# EAGLE design filaSens (EAGLE 9.6.2)
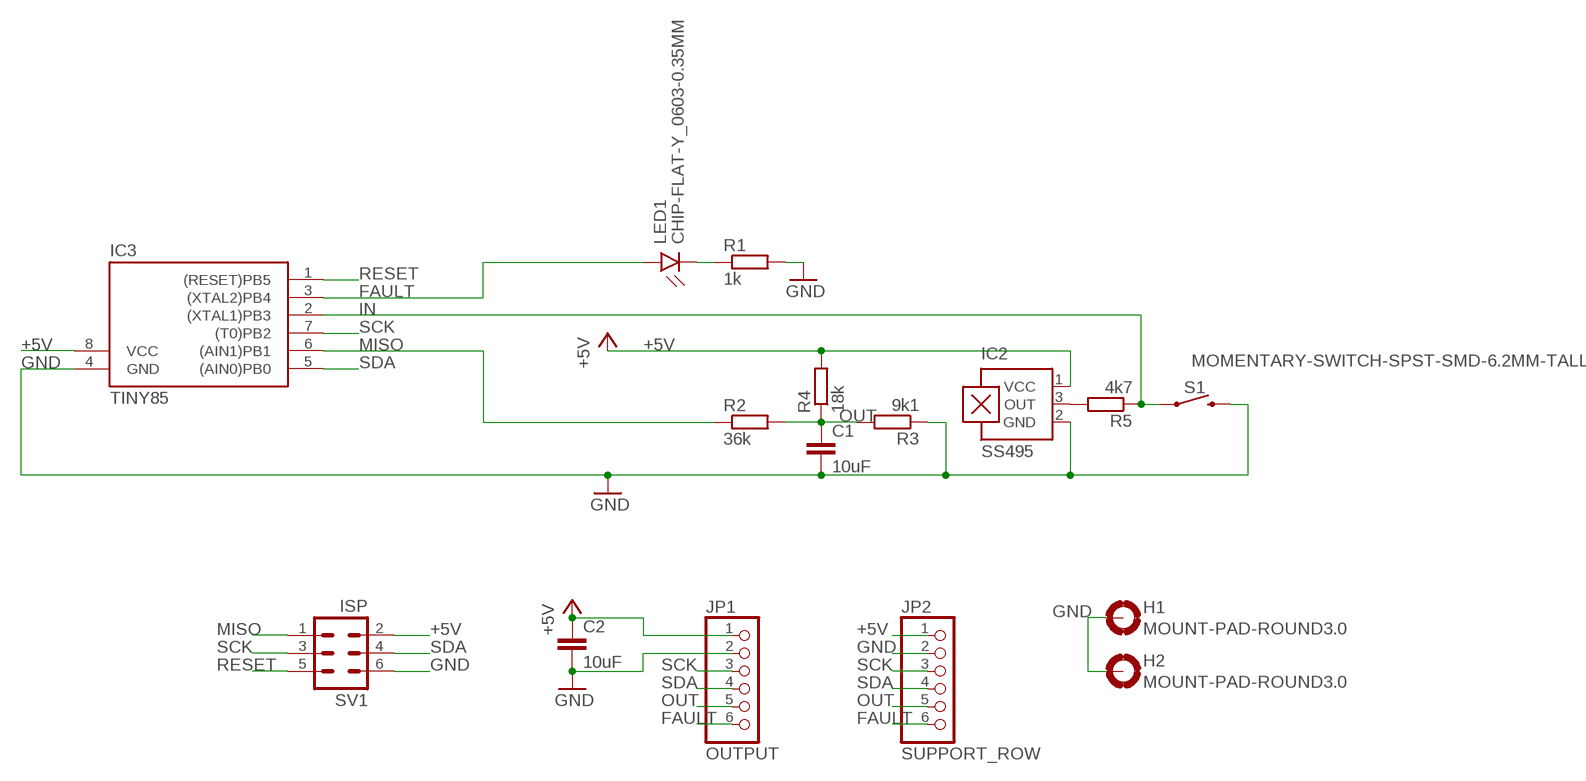
[diagram p0: schematic, sheet 1]

## Parts
C1  10uF  C-EUC0402  [C0402]
C2  10uF  C-EUC0402  [C0402]
H1  MOUNT-PAD-ROUND3.0  [3,0-PAD]
H2  MOUNT-PAD-ROUND3.0  [3,0-PAD]
IC2  SS495  A1302UA  [SIP3-UA]
IC3  TINY85  TINY10S  [SOIC8]
JP1  OUTPUT  PINHD-1X6  [1X06]
JP2  SUPPORT_ROW  PINHD-1X6  [1X06]
LED1  CHIP-FLAT-Y_0603-0.35MM  [LEDC1608X35N_FLAT-Y]
R1  1k  R-EU_R0402  [R0402]
R2  36k  R-EU_R0402  [R0402]
R3  9k1  R-EU_R0402  [R0402]
R4  18k  R-EU_R0402  [R0402]
R5  4k7  R-EU_R0402  [R0402]
S1  MOMENTARY-SWITCH-SPST-SMD-6.2MM-TALL  [TACTILE_SWITCH_SMD_6.2MM_TALL]
SV1  ISP  MA03-2  [MA03-2]

## Nets
+5V [power]: C2.1 IC2.1(VCC) IC3.8(VCC) JP1.1 JP2.1 R4.2 SV1.2
FAULT: IC3.3((XTAL2)PB4) JP1.6 JP2.6 LED1.A
GND [power]: C1.2 C2.2 H1.B3,0(MOUNT) H2.B3,0(MOUNT) IC2.2(GND) IC3.4(GND) JP1.2 JP2.2 R1.2 R3.1 S1.B2 SV1.6
IN: IC3.2((XTAL1)PB3) R5.1 S1.A2
MISO: IC3.6((AIN1)PB1) R2.1 SV1.1
N$1: IC2.3(OUT) R5.2
N$2: LED1.C R1.1
OUT: C1.1 JP1.5 JP2.5 R2.2 R3.2 R4.1
RESET: IC3.1((RESET)PB5) SV1.5
SCK: IC3.7((T0)PB2) JP1.3 JP2.3 SV1.3
SDA: IC3.5((AIN0)PB0) JP1.4 JP2.4 SV1.4

## Library data of the parts
C1 C2 = rcl:C-EU: CAPACITOR, European symbol; SPICEPREFIX: C
H1 H2 = holes:MOUNT-PAD-ROUND: MOUNTING PAD, round
IC2 = allegro:A13*?: Linear Hall Effect Sensor ICs Continuous-Time Ratiometric High-Temperature Operation Programmable Linear with Analog Output A1302 -Replacement- UGN3503 Source: http://www.allegromicro.com/en/Products/Part_Numbers/1301/1301.pdf http://www.allegromicro.com/en/Products/Part_Numbers/1321/1321.pdf http://www.allegromicro.com/en/Products/Part_Numbers/1381/1381.pdf; MF: ALLEGRO MICROSYSTEMS, INC.; MPN: A1302EUA-T; OC_FARNELL: 1521708; OC_NEWARK: 31K6639
IC3 = atmel:TINY10: MICROCONTROLLER 1 Kbytes ROM; OC_FARNELL: unknown; OC_NEWARK: unknown
JP1 JP2 = pinhead:PINHD-1X6: PIN HEADER
LED1 = LED:CHIP-FLAT-Y; CATEGORY: LED; COLOR: YELLOW; DESCRIPTION: CHIP LED FLAT; SUB-CATEGORY: CHIP; TYPE: FLAT_TOP
R1-R5 = rcl:R-EU_: RESISTOR, European symbol; SPICEPREFIX: R
S1 = SparkFun-Switches:MOMENTARY-SWITCH-SPST: Momentary Switch (Pushbutton) - SPST Normally-open (NO) SPST momentary switches (buttons, pushbuttons). Variants PTH-12MM - 12mm square, through-hole Momentary Pushbutton Switch - 12mm Square <https://www.sparkfun.com/products/9190> (COM-09190) PTH-6.0MM, PTH-6.0MM-KIT - 6.0mm square, through-hole Mini Pushbutton Switch <https://www.sparkfun.com/products/97> (COM-00097) KIT package intended for soldering kit's - only one side of pads' copper is exposed. PTH-RIGHT-ANGLE-KIT - Right-angle, through-hole Right Angle Tactile Button <https://www.sparkfun.com/products/10791> - Used on SparkFun BigTime Watch Kit <https://www.sparkfun.com/products/11734> SMD-12MM - 12mm square, surface-mount Tactile Button - SMD (12mm) <https://www.sparkfun.com/products/12993> (COM-12993) Used on SparkFun PicoBoard <https://www.sparkfun.com/products/11888> SMD-4.5MM - 4.5mm Square Trackball Switch Used on SparkFun Blackberry Trackballer Breakout <https://www.sparkfun.com/products/13169> SMD-4.6MMX2.8MM - 4.60mm x 2.80mm, surface mount Used on SparkFun SAMD21 Mini Breakout <https://www.sparkfun.com/products/13664> SMD-5.2MM, SMD-5.2-REDUNDANT - 5.2mm square, surface-mount Mini Pushbutton Switch - SMD <https://www.sparkfun.com/products/8720> (COM-08720) Used on Arduino Pro Mini <https://www.sparkfun.com/products/11114> REDUNDANT package connects both switch circuits together SMD-6.0X3.5MM - 6.0 x 3.5mm, surface mount Momentary Reset Switch SMD <https://www.sparkfun.com/products/8229> (COM-08229) SMD-6.2MM-TALL - 6.2mm square, surface mount Tactile Button - SMD (6mm) <https://www.sparkfun.com/products/12992> Used on SparkFun Digital Sandbox <https://www.sparkfun.com/products/12651> SMD-RIGHT-ANGLE - Right-angle, surface mount Used on SparkFun Block for Intel® Edison - Arduino <https://www.sparkfun.com/products/13036>; PROD_ID: SWCH-11966; SF_SKU: COM-12992
SV1 = con-lstb:MA03-2: PIN HEADER; OC_FARNELL: unknown; OC_NEWARK: unknown

## Net classes
0 default: width 0.254 mm
1 power: width 0.254 mm

## Board
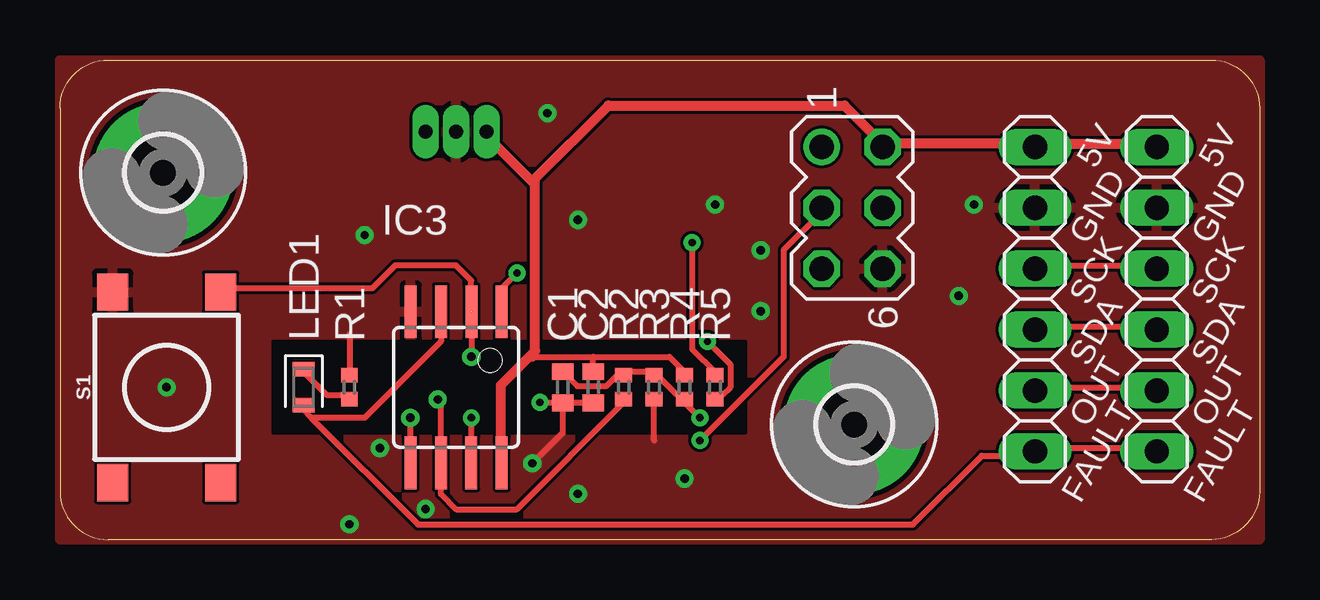
[diagram p1: board, top side]
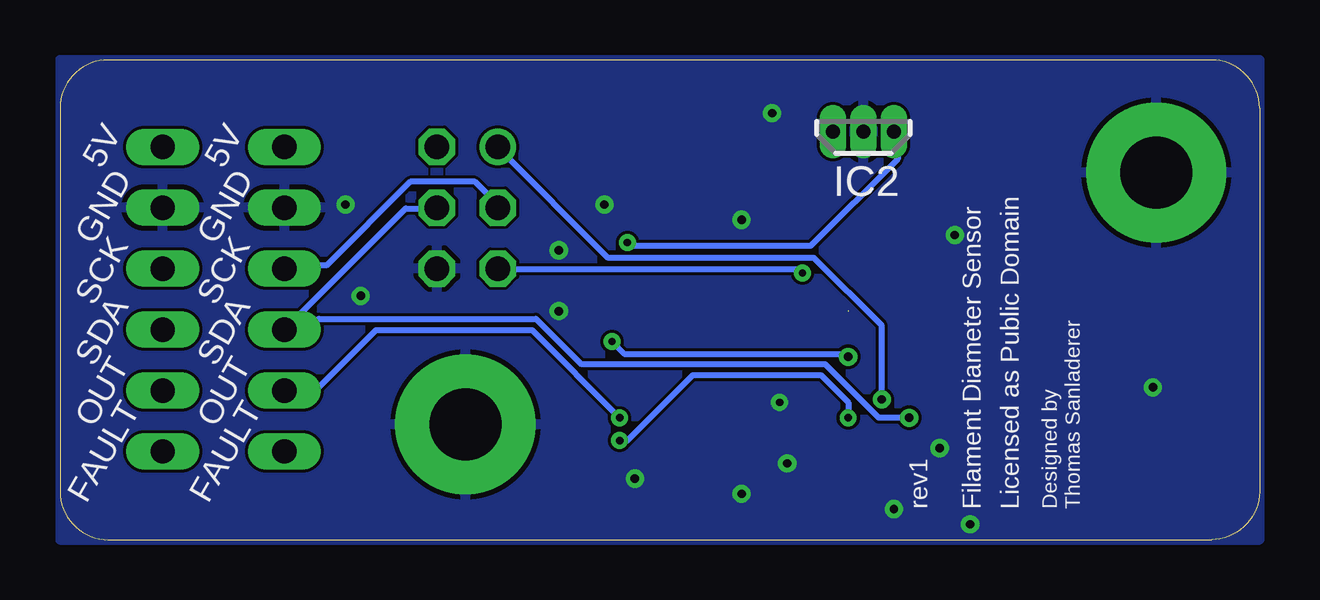
[diagram p2: board, bottom side, seen from below]

Size 50 x 20 mm. Coordinates in mm from the lower left corner, seen from the top.
Outline: 0,18 0,2 arc90 2,0 48,0 arc90 50,2 50,18 arc90 48,20 2,20 arc90 0,18
Copper layers (1*16): Top 0.035mm / dielectric 1.5mm / Bottom 0.035mm
Design rules "default *": minimum track width 10mil, minimum drill 0.3mm, track to track 5mil, track to pad 5mil, pad to pad 5mil, via to via 5mil, smd to smd 5mil, copper to edge 0mil, drill to drill 8mil, minimum pad ring 10mil, minimum via ring 8mil, stop-mask expansion 4mil, vias tented up to drill 28mil, thermal gap 8mil

### Footprints (pad centres in the part's own frame; a part is rotated, then mirrored left to right if it is on the bottom)
C0402 = smd 0.7 x 0.9: 1 -0.65,0; 2 0.65,0
3,0-PAD = drill 3 pad 5.842: B3,0 0,0
SIP3-UA = drill 0.6 pad 0.7 long: 1 -1.27,0; 2 0,0; 3 1.27,0
SOIC8 = smd 0.5 x 2.2: 1 -1.905,-3.154; 2 -0.645,-3.154; 3 0.625,-3.154; 4 1.895,-3.154; 5 1.905,3.154; 6 0.635,3.154; 7 -0.635,3.154; 8 -1.905,3.154
1X06 = drill 1.016 long: 1 -6.35,0; 2 -3.81,0; 3 -1.27,0; 4 1.27,0; 5 3.81,0; 6 6.35,0
LEDC1608X35N_FLAT-Y = smd 0.612 x 0.912: A 0.75,0; C -0.75,0
R0402 = smd 0.6 x 0.7: 1 -0.5,0; 2 0.5,0
TACTILE_SWITCH_SMD_6.2MM_TALL = smd 1.55 x 1.3: A1 -3.975,-2.25; A2 3.975,-2.25; B1 -3.975,2.25; B2 3.975,2.25
MA03-2 = drill 1.016: 1 -2.54,-1.27 | drill 1.016 octagon: 2 -2.54,1.27; 3 0,-1.27; 4 0,1.27; 5 2.54,-1.27; 6 2.54,1.27

### Placement (x,y rotation side)
C1  20.95,6.35 270 top
C2  22.23,6.35 270 top
H1  33.1,4.8 0 top
H2  4.3,15.3 0 top
IC2  16.51,17.01 0 bottom
IC3  16.51,6.35 180 top
JP1  40.64,10.03 270 top
JP2  45.72,10.03 270 top
LED1  10.16,6.35 270 top
R1  12.06,6.35 90 top
R2  23.5,6.35 90 top
R3  24.77,6.35 90 top
R4  26.04,6.35 90 top
R5  27.3,6.35 90 top
S1  4.45,6.35 90 top
SV1  33.02,13.84 270 top

### Tracks (layer width: path | path; a pad name or v marks a point on that pad's centre or on a via)
+5V
  Top 0.254: 45.72,16.51 JP2.1 | 40.64,16.51 JP1.1 | 19.68,7.62 22.23,7.62 | 22.23,7.62 25.4,7.62 26.04,6.99 R4.2 | 17.78,16.83 IC2.1 | 34.29,16.51 SV1.2 | 18.38,3.24 IC3.8 | C2.1 22.23,7.62
  Top 0.406: 45.72,16.51 40.64,16.51 34.29,16.51 32.7,18.1 22.86,18.1 19.81,15.05 | 19.68,7.75 18.38,6.45 18.38,3.24 | 19.68,7.75 19.81,7.87 19.81,15.05 | 17.78,16.83 19.68,14.92 19.81,15.05 | 19.68,7.62 19.68,7.75
FAULT
  Top 0.254: JP2.6 45.72,3.81 40.64,3.81 JP1.6 40.64,3.49 38.42,3.49 35.56,0.64 14.92,0.64 10.48,5.08 | 10.48,5.08 10.16,5.4 LED1.A | 10.48,5.08 12.7,5.08 15.88,8.26 15.88,9.21 IC3.3
GND  (via drill 0.3, 0.35)
  Top 0.254: 24.77,4.13 R3.1 | 12.06,8.57 R1.2 | C2.2 C1.2 | C1.2 20.95,4.45 v19.68,3.17 | v20,5.71 20.94,5.71 C1.2
  other vias: 21.59,13.34 27.3,13.97 29.21,12.06 37.47,10.16 38.1,13.97 4.45,6.35 13.34,3.81 21.59,1.91 26.04,2.54 29.21,9.53 15.24,1.27 12.06,0.64 12.7,12.7 20.32,17.78
  pour Bottom: 0,20 50,20 50,0 0,0
  pour Top (rank 3): 0,20 50,20 50,0 0,0
  cutout Top (rank 2): 8.89,4.45 8.89,8.26 28.57,8.26 28.57,4.45
IN  (via drill 0.3, 0.35)  (1 unrouted)
  Top 0.254: v26.99,8.26 27.94,7.3 27.94,6.35 27.62,6.03 27.3,6.03 R5.1 | 17.14,9.53 17.14,10.79 16.51,11.43 13.97,11.43 13.02,10.48 6.99,10.48 S1.A2 | IC3.2 17.16,7.63 v17.14,7.62
  Bottom 0.254: v17.14,7.62 17.27,7.75 26.48,7.75 v26.99,8.26
MISO  (via drill 0.35)
  Top 0.254: R2.1 23.5,5.71 19.05,1.27 16.51,1.27 15.88,1.91 IC3.6 15.88,5.71 v15.74,5.84
  Bottom 0.254: SV1.1 31.75,16.35 27.15,11.75 18.57,11.75 15.74,8.92 v15.74,5.84
N$1  (via drill 0.3)
  Top 0.254: v26.35,12.38 26.35,7.94 27.3,6.99 R5.2
  Bottom 0.254: v26.35,12.38 26.23,12.26 18.7,12.26 15.08,15.88 15.08,16.99 15.24,16.99 IC2.3
N$2
  Top 0.254: R1.1 12.06,6.03 11.11,6.03 10.16,6.99 LED1.C
OUT  (via drill 0.3)
  Top 0.254: 24.77,6.99 23.5,6.99 | 24.77,6.99 25.72,6.03 26.04,6.03 R4.1 26.04,5.71 v26.67,5.08 | 24.77,6.99 R3.2 | 23.5,6.99 R2.2 | JP2.5 45.72,6.35 40.64,6.35 JP1.5 | 23.5,6.99 23.37,6.99 22.78,6.4 21.56,6.4 C1.1
  Bottom 0.254: v26.67,5.08 30.32,8.73 36.83,8.73 39.21,6.35 40.64,6.35 JP1.5
RESET  (via drill 0.3)
  Top 0.254: IC3.1 18.41,10.48 v19.05,11.11
  Bottom 0.254: SV1.5 31.75,11.27 19.05,11.27 18.97,11.19 v19.05,11.11
SCK  (via drill 0.3)
  Top 0.254: v17.14,5.08 IC3.7 | v26.67,4.13 30.16,7.62 30.16,12.06 31.75,13.65 SV1.3 | JP2.3 45.72,11.43 40.64,11.43 JP1.3
  Bottom 0.254: JP1.3 40.64,11.43 38.89,11.43 35.4,14.92 32.7,14.92 31.75,13.97 SV1.3 | v17.14,5.08 17.14,5.71 18.29,6.86 23.62,6.86 26.35,4.13 v26.67,4.13
SDA  (via drill 0.35)
  Top 0.254: JP2.4 45.72,8.89 40.64,8.89 JP1.4 | IC3.5 v14.61,5.08
  Bottom 0.254: SV1.4 34.29,13.81 35.58,13.81 JP1.4 40.64,8.89 39.53,8.89 39.21,9.21 30.16,9.21 28.26,7.3 18.1,7.3 15.88,5.08 v14.61,5.08

### Text on the board
tNames: 5V | 5V | GND | GND | SCK | SCK | SDA | SDA | OUT | OUT | FAULT | FAULT
bNames: 5V | 5V | GND | GND | SCK | SCK | SDA | SDA | OUT | OUT | Designed by / Thomas Sanladerer | Licensed as Public Domain | Filament Diameter Sensor | rev1 | FAULT | FAULT